# Altium schematic sheet H2AR1_Frontend 1.SchDoc
size Letter; CompanyName: Hexabitz; DocumentNumber: 2; SheetNumber: 2; SheetTotal: 3
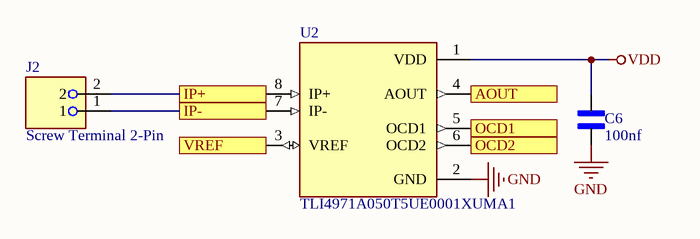
[diagram p0: H2AR1_Frontend 1.SchDoc]

## Parts
C6  100nf  [CAPC1608X90N]
J2  Screw Terminal 2-Pin  [PHOENIX_1935161]
U2  TLI4971A050T5UE0001XUMA1  [IC_TLI4971A050T5UE0001XUMA1]

## Ports
AOUT, IP+, IP-, OCD1, OCD2, VREF

## Nets
GND: C6.2 U2.2(GND)
VDD: C6.1 U2.1(VDD)
AOUT: U2.4(AOUT) ; port AOUT
IP+: J2.2 U2.8(IP+) ; port IP+
IP-: J2.1 U2.7(IP-) ; port IP-
OCD1: U2.5(OCD1) ; port OCD1
OCD2: U2.6(OCD2) ; port OCD2
VREF: U2.3(VREF) ; port VREF

## Notes on the sheet
- Module:
- Title:
- Description:
- Size:
- Revision:
- Letter
- www.hexabitz.com
- Date:
- Time:
- Sheet
- of

## Library data of the parts
C6 = GRM188R71E474KA12D: SMD capacitor X7R(EIA) with capacitance 0.47uF Tol.10%. Rated voltage 25Vdc 125C; MF: Murata; SnapEDA_Link: https://www.snapeda.com/parts/GRM188R71E474KA12D/Murata/view-part/?ref=snap; Package: 1608 Murata; Value: 100nf; MP: GRM188R71E474KA12D; Check_prices: https://www.snapeda.com/parts/GRM188R71E474KA12D/Murata/view-part/?ref=eda
J2 = 1935161: PCB Terminal Screw 5mm 16AWG 400V 17.5A 2 Position COMBICON PT Series | Phoenix Contact 1935161; Value: 2-Pin Terminal; SnapEDA_Link: https://www.snapeda.com/parts/1935161/Phoenix+Contact/view-part/?ref=snap; Package: None; MF: Phoenix Contact; MP: 1935161; Check_prices: https://www.snapeda.com/parts/1935161/Phoenix+Contact/view-part/?ref=eda
U2 = TLI4971A050T5UE0001XUMA1: Current Sensor 50A 1 Channel Hall Effect, Open Loop Unidirectional 8-PowerTDFN; MF: Infineon Technologies; SnapEDA_Link: https://www.snapeda.com/parts/TLI4971A050T5UE0001XUMA1/Infineon/view-part/?ref=snap; Package: PowerTDFN-8 Infineon Technologies; Value: *; MP: TLI4971A050T5UE0001XUMA1; Check_prices: https://www.snapeda.com/parts/TLI4971A050T5UE0001XUMA1/Infineon/view-part/?ref=eda